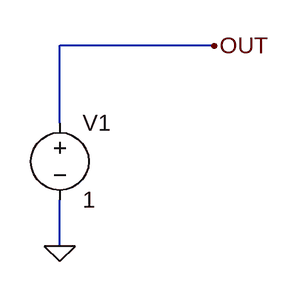
[diagram p0: schematic selector-on.asc]
selector-on.asc, the LTspice schematic file:
Version 4
SHEET 1 1108 680
WIRE 112 -400 -48 -400
WIRE -48 -320 -48 -400
WIRE -48 -192 -48 -240
FLAG 112 -400 OUT
FLAG -48 -192 0
SYMBOL voltage -48 -336 R0
WINDOW 123 0 0 Left 2
WINDOW 39 0 0 Left 2
SYMATTR InstName V1
SYMATTR Value 1

The netlist it stands for:
* selector-on.asc
V1 OUT 0 1
.backanno
.end